# Altium schematic sheet D33_POWER_SCHEMATIC.SchDoc
size A3; SheetNumber: 4; SheetTotal: 7
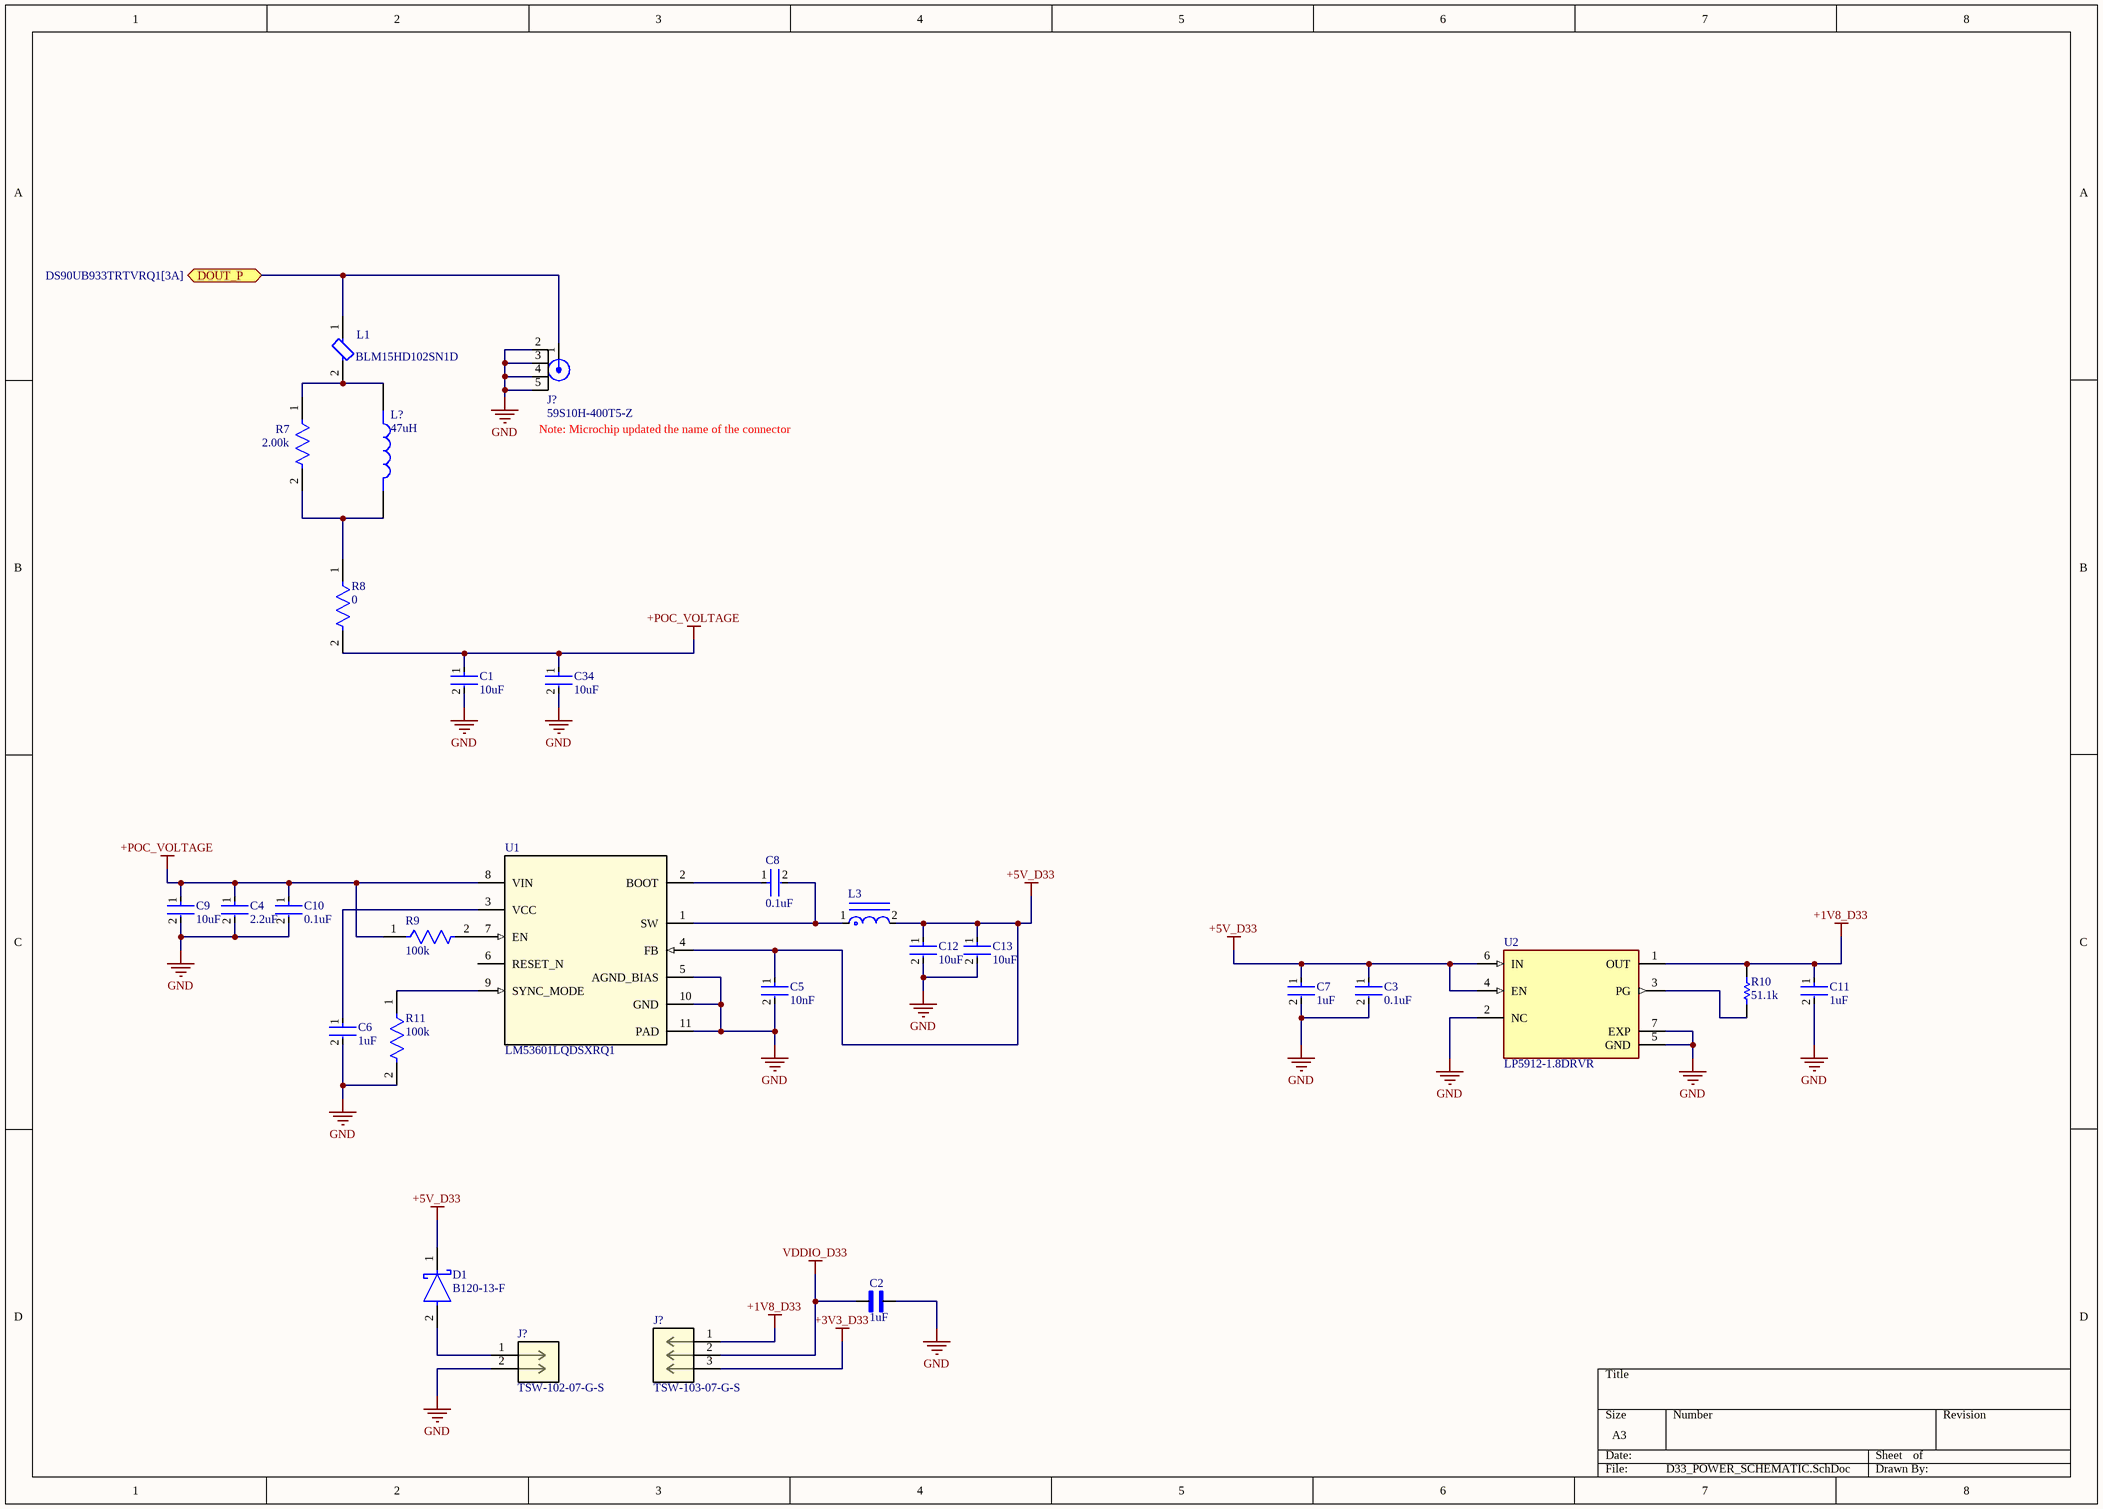
[diagram p0: D33_POWER_SCHEMATIC.SchDoc]

## Parts
(Parts that share a designator on the sheet are numbered #1, #2 ... from top to bottom, then left to right.)
C1  10uF  [FP-GRM188-0_2-MFG]
C2  1uF  [CAPC2012X94N]
C3  0.1uF  [FP-C1005-050-0_05-IPC_C]
C4  2.2uF  [FP-GRT155-0_2-IPC_C]
C5  10nF  [FP-GCM155-0_05-IPC_C]
C6  1uF  [FP-C1005-050-0_05-IPC_B]
C7  1uF  [FP-GRM15-0_1-MFG]
C8  0.1uF  [FP-C1005-050-0_05-IPC_C]
C9  10uF  [FP-GRM188-0_2-MFG]
C10  0.1uF  [FP-C1005-050-0_05-IPC_C]
C11  1uF  [FP-C1005-050-0_05-IPC_B]
C12  10uF  [FP-GRM188-0_2-MFG]
C13  10uF  [FP-GRM188-0_2-MFG]
C34  10uF  [FP-GRM188-0_2-MFG]
D1  B120-13-F  [FP-SMA-MFG]
J?#1  59S10H-400T5-Z  [59S10H400T5Z]
J?#2  TSW-103-07-G-S  [CON3_1X3_TU_TSW]
J?#3  TSW-102-07-G-S  [CON2_1X2_TU_TSW]
L1  BLM15HD102SN1D  [FP-BLM15-0_05-IPC_C]
L3  (no value)  [FP-MPI4020V2-MFG]
L?  47uH  [IND_ADL3225V-470MT-TL000]
R7  2.00k  [FP-CRCW0402-e3-IPC_C]
R8  0  [FP-CRCW0402-e3-IPC_C]
R9  100k  [FP-CRCW0402-e3-IPC_C]
R10  51.1k  [RESC1005X40X25NL05T05]
R11  100k  [FP-CRCW0402-e3-IPC_C]
U1  LM53601LQDSXRQ1  [DSX0010A]
U2  LP5912-1.8DRVR  [SON65P200X200X80-7N]

## Ports
DOUT_P (bidir, see DS90UB933TRTVRQ1[3A])

## Nets
+1V8_D33: C11.1 J?#2.1 R10.2 U2.1(OUT)
+3V3_D33: J?#2.3
+5V_D33: C3.1 C5.1 C7.1 C12.1 C13.1 D1.1(C) L3.2 U1.4(FB) U2.4(EN) U2.6(IN)
+POC_VOLTAGE: C1.1 C4.1 C9.1 C10.1 C34.1 R8.2 R9.1 U1.8(VIN)
GND: C1.2 C2.1 C3.2 C4.2 C5.2 C6.2 C7.2 C9.2 C10.2 C11.2 C12.2 C13.2 C34.2 J?#1.2 J?#1.3 J?#1.4 J?#1.5 J?#3.2 R11.2 U1.5(AGND_BIAS) U1.10(GND) U1.11(PAD) U2.2(NC) U2.5(GND) U2.7(EXP)
VDDIO_D33: C2.2 J?#2.2
DOUT_P: J?#1.1 L1.1 ; port DOUT_P
NetC6_1: C6.1 U1.3(VCC)
NetC8_1: C8.1 U1.2(BOOT)
NetC8_2: C8.2 L3.1 U1.1(SW)
NetD1_2: D1.2(A) J?#3.1
NetL1_2: L1.2 L?.1 R7.1
NetL?_2: L?.2 R7.2 R8.1
NetR9_2: R9.2 U1.7(EN)
NetR10_1: R10.1 U2.3(PG)
NetR11_1: R11.1 U1.9(SYNC_MODE)

Not connected (* = marked no-connect by the designer): U1 6(RESET_N)

## Notes on the sheet
- (near J?#1) Note: Microchip updated the name of the connector

## Library data of the parts
C1 C9 C12 C13 C34 = CMP-2006-02520-2: Chip Multilayer Ceramic Capacitors for General Purpose, 0603, 10uF, X5R, 15%, 20%, 25V; Tolerance: 20%; Resistor Type: Ceramic; Voltage: 25V; Max Operating Temperature: 85°C; Min Operating Temperature: -55°C; Capacitance: 10uF; Dielectric: X5R; Lead Free: Lead Free; REACH SVHC: No SVHC; Case/Package: 0603; Mount: Surface Mount; Voltage Rating (DC): 25V; Height: 0.8mm; Length: 1.6mm; Thickness: 0.031inch; Width: 0.031inch; Termination: SMD/SMT; Case Code (Imperial): 0603; Case Code (Metric): 1608; Package Quantity: 1; Packaging: Tape and Reel; Depth: 0.8mm; Voltage Rating: 25V; Weight: 0.000222oz; Number of Pins: 2
C2 = 08055C105KAT2A: 1 ÂµF Â±10% 50V Ceramic Capacitor X7R 0805 (2012 Metric); MF: KYOCERA AVX Components Corporation; SnapEDA_Link: https://www.snapeda.com/parts/08055C105KAT2A/Kyocera/view-part/?ref=snap; Package: 2012 AVX; Value: *; MP: 08055C105KAT2A; Check_prices: https://www.snapeda.com/parts/08055C105KAT2A/Kyocera/view-part/?ref=eda
C3 C8 C10 = CMP-2000-05393-2: Multilayer Ceramic Capacitors 100nF ±10% 50V X7R SMD 0402; Voltage: 50V; Dielectric Material: Ceramic; Min Operating Temperature: -55°C; Depth: 0.5mm; Radiation Hardening: No; RoHS Compliant: Yes; Voltage Rating (DC): 50V; Lead Free: Lead Free; Resistor Type: Ceramic; Height: 0.5mm; Dielectric: X7R; Thickness: 0.022inch; Case/Package: 0402; Case Code (Metric): 1005; Termination: SMD/SMT; Capacitance: 100nF; Packaging: Tape and Reel; Max Operating Temperature: 125°C; Mount: Surface Mount; Package Quantity: 1; Width: 0.02inch; Weight: 2.3E-05oz; Voltage Rating: 50V; Tolerance: 10%; Construction: Flat; Case Code (Imperial): 0402; Length: 1mm; REACH SVHC: No SVHC; Series: C
C4 = CMP-06035-059281-1: Multi-Layer Ceramic Capacitor 2.2uF 25V X5R ±10% 0402 Paper T/R; Max Operating Temperature: 85°C; Case Code (Imperial): 0402; Width: 0.02inch; Min Operating Temperature: -55°C; Voltage Rating (DC): 25V; Tolerance: 10%; Length: 0.039inch; Ratings: AEC-Q200; Dielectric: X5R; Case Code (Metric): 1005; Thickness: 0.022inch; Voltage Rating: 25V; Packaging: Cut Tape; Case/Package: 0402; Mount: Surface Mount; Capacitance: 2.2uF
C5 = CMP-2008-03723-3: Ceramic Capacitor for Automotive 10nF ±10% 50VDC X7R 0402 Paper T/R; Voltage Rating (DC): 50V; Min Operating Temperature: -55°C; Radiation Hardening: No; Mount: Surface Mount; Thickness: 0.022inch; Package Quantity: 1; Case Code (Imperial): 0402; Lead Free: Lead Free; Case/Package: 0402; Depth: 0.5mm; Termination: SMD/SMT; Tolerance: 10%; Voltage: 50V; Packaging: Tape and Reel; Width: 0.02inch; REACH SVHC: No SVHC; Height: 0.5mm; Max Operating Temperature: 125°C; Case Code (Metric): 1005; Voltage Rating: 50V; Capacitance: 10nF; Ratings: AEC-Q200; Length: 1mm; Dielectric: X7R
C6 C11 = CMP-2000-06001-2: Multilayer Ceramic Capacitors 1μF ±10% 25V X5R SMD 0402; Package Quantity: 1; Radiation Hardening: No; Dielectric: X5R; REACH SVHC: No SVHC; RoHS Compliant: Yes; Case Code (Imperial): 0402; Voltage Rating: 25V; Termination: SMD/SMT; Max Operating Temperature: 85°C; Capacitance: 1uF; Series: C; Packaging: Tape and Reel; Tolerance: 10%; Voltage Rating (DC): 25V; Weight: 2.3E-05oz; Height: 0.5mm; Resistor Type: Ceramic; Thickness: 0.022inch; Min Operating Temperature: -55°C; Length: 1mm; Lead Free: Lead Free; Depth: 0.5mm; Dielectric Material: Ceramic; Width: 0.02inch; Case/Package: 0402; Case Code (Metric): 1005; Mount: Surface Mount
C7 = CMP-2008-04556-2: CAP CER 1UF 10V X5R 0402; Manufacturer Part Number: GRM155R61A105KE15D; Manufacturer: Murata; Material: Ceramic; Tolerance: 10%; Temperature Coefficient: 15%; Octopart: https://octopart.com/grm155r61a105ke15d-murata-197442; Lead Free: Yes; ComponentLink2Description: Datasheet; Temperature: -55°C to +85°C; Temperature Range High: +85°C; Height: 0.55mm; Capacitance: 1uF; Ipc Land Pattern Name: CAPC10050X50; ComponentLink2URL: https://search.murata.co.jp/Ceramy/image/img/A01X/G101/ENG/GRM155R61A105KE15-01A.pdf; Temperature Range Low: -55°C; Device Class L2: Capacitors; Voltage Rating: 10V; RoHS: TRUE; Device Class L1: Passive Components; Device Class L3: Ceramic Capacitors; Temperature Characteristic: X5R; Mouser Description: 0402 1 uF 10 V ±10% Tolerance X5R Surface Mount Multilayer Ceramic Capacitor; Automotive: No; Package: GRM15-0.1; Digikey Description: CAP CER 1UF 10V X5R 0402; Value: 1uF; Category: Cap
D1 = CMP-12790-000051-1: DIODE SCHOTTKY 20V 1A SMA; Manufacturer: Diodes Inc.; Value: 110pF; Standoff Height: 0.05mm; Max Junction Temp: +150°C; Max Surge Forward Current: 30A; Peak Reverse Current: 0.5mA; Height: 2.4mm; Temperature Range High: +150°C; Category: Diode; ComponentLink2Description: Datasheet; Forward Current: 1A; Device Class L1: Discrete Semiconductors; Footprint Url: https://www.diodes.com/assets/Package-Files/SMA.pdf; Device Class L3: Schottky Diodes; Reverse Voltage: 20V; Mouser Description: Schottky Diodes & Rectifiers 20V 1A; Temperature Range Low: -65°C; Automotive: No; Octopart: https://octopart.com/b120-13-f-diodes+inc.-40148653; Digikey Description: DIODE SCHOTTKY 20V 1A SMA; RoHS: TRUE; Lead Free: Yes; Manufacturer Part Number: B120-13-F; Package: SMA; Temperature: -65°C to +150°C; Capacitance: 110pF; Max Repetitive Reverse Voltage: 20V; ComponentLink2URL: https://www.diodes.com/assets/Datasheets/ds13002.pdf; Device Class L2: Diodes
J?#1 = 59S10H-400T5-Z: Connector; Manufacturer_Name: Rosenberger; Datasheet Link: https://products.rosenberger.com/radio-frequency/connectors/190827/59s10h-400t5-z-straight-plug-pcb-w.-housing#; Height: 12.45mm; Manufacturer_Part_Number: 59S10H-400T5-Z; Mouser Part Number: 476-59S10H-400T5-Z; Mouser Price/Stock: https://www.mouser.co.uk/ProductDetail/Rosenberger/59S10H-400T5-Z?qs=ehM%252BESVsXgwk%252Bgn9X1DFpA%3D%3D
J?#2 = TSW-103-07-G-S: Description; Manufacturer_Name: Samtec Inc; Copyright: Copyright (C) 2025 Ultra Librarian. All rights reserved.; Manufacturer_Part_Number: TSW-103-07-G-S; RefDes: RefDes; Type: Type
J?#3 = TSW-102-07-G-S: Description; Manufacturer_Name: Samtec Inc; Copyright: Copyright (C) 2025 Ultra Librarian. All rights reserved.; Manufacturer_Part_Number: TSW-102-07-G-S; RefDes: RefDes; Type: Type
L1 = CMP-0686-00279-4: Chip Ferrite Bead, 0402, 1000Ω @ 100MHz, 1.25Ω, 25%, 250mA; Manufacturer Series: BLM15H; Number of Functions: 1; DC Resistance-Max: 1.25R; Impedance: 1kR; Shielding: Unshielded; Material: Steel; Series: BLM15H; Case Code (Metric): 1005; Contact Plating: Tin; Width: 0.5mm; Current Rating: 250mA; Number of Circuits: 1; Min Operating Temperature: -55°C; Number of Pins: 2; Core Material: Ferrite; Packaging: Tape and Reel; DC Resistance (DCR): 1.25R; Height: 0.5mm; REACH SVHC: No SVHC; Max Current Rating: 250mA; Depth: 0.5mm; Tolerance: 25%; Termination: SMD/SMT; RoHS Compliant: Yes; Package Quantity: 1; Number of Lines: 1; Max DC Current: 250mA; Radiation Hardening: No; Resistance: 1.25R; Lead Free: Lead Free; DC Current: 250mA; Length: 1mm; Test Frequency: 100MHz; Frequency: 100MHz; Case Code (Imperial): 0402; Max Operating Temperature: 125°C; Case/Package: 0402; Military Standard: Not
L3 = CMP-00112-75645210-1: MPI4020V2-4R7-R Inductor Power Shielded Wirewound 4.7uH 20% 100KHz 2.7A 118mOhm DCR; Current Rating: 2.8A; Self Resonant Frequency: 24MHz; Resistance: 118mΩ; DC Resistance (DCR): 105mΩ; Saturation Current: 3A; Inductance: 4.7µH; Min Operating Temperature: -55°C; Length: 3.9878mm; Tolerance: 20%; Max Operating Temperature: 125°C; Composition: Wirewound; RoHS: Compliant; Shielding: Shielded; Width: 3.9878mm; Series Resistance: 118mΩ; Height: 2mm; Test Frequency: 100kHz; Height - Seated (Max): 2.032mm; Mount: Surface Mount; RMS Current (Irms): 2.7A; NexarPartId: 75645210
L? = ADL3225V-470MT-TL000: MF: {'manufacturer': u'TDK'}; Value: *; Availability: Unavailable; MP: ADL3225V-470MT-TL000; Price: None; Package: None
R7 R8 = CMP-2002-08122-2: RES Thick Film, 0Ω, 0.063W, 0402; Tolerance: 5%; Max Power Dissipation: 63mW; Voltage Rating: 50V; Temperature Coefficient: 100ppm/°C; Resistance: 0mR; Contact Plating: Tin; Height: 0.35mm; Radiation Hardening: No; Features: Automotive AEC-Q200; Composition: Thick Film; Width: 0.5mm; Weight: 2.3E-05oz; Termination: SMD/SMT; Packaging: Tape and Reel; Mount: Surface Mount; Case Code (Metric): 1005; Military Standard: Not; Min Operating Temperature: -55°C; Number of Terminations: 2; Package Quantity: 1; Case Code (Imperial): 0402; Depth: 0.5mm; Max Operating Temperature: 155°C; Case/Package: 0402; Power Rating: 63mW; Lead Free: Lead Free; Voltage Rating (DC): 50V; Length: 1mm
R9 R11 = CMP-2002-08123-3: RES Thick Film, 100kΩ, 1%, 0.063W, 100ppm/°C, 0402; Power Rating: 63mW; Resistance: 100kR; Voltage Rating (DC): 50V; Lead Free: Lead Free; Height: 0.35mm; Contact Plating: Tin; Min Operating Temperature: -55°C; Package Quantity: 10000; Case/Package: 0402; Temperature Coefficient: 100ppm/°C; Number of Terminations: 2; Packaging: Tape and Reel; Max Power Dissipation: 63mW; Case Code (Metric): 1005; Mount: Surface Mount; Width: 0.02inch; Termination: SMD/SMT; Length: 1mm; Number of Pins: 2; Weight: 2.3E-05oz; Radiation Hardening: No; Tolerance: 1%; Military Standard: Not; Features: Automotive AEC-Q200; Depth: 0.5mm; Composition: Thick Film; Max Operating Temperature: 155°C; Voltage Rating: 50V; Case Code (Imperial): 0402
R10 = CMP-2002-00975-1: Manufacturer: Panasonic; Part Number: ERJ-2RKF5112X
U1 = LM53601LQDSXRQ1: Automotive 3.5-V to 36-V, 1-A synchronous 2.1-MHz step-down converter 10-WSON -40 to 150; Manufacturer_Name: Texas Instruments; TYPE: TYPE; RefDes: RefDes; Copyright: Copyright (C) 2025 Ultra Librarian. All rights reserved.; Manufacturer_Part_Number: LM53601LQDSXRQ1; Datasheet: https://www.ti.com/lit/gpn/lm53601-q1
U2 = LP5912-1.8DRVR: 500-mAÂ low-noiseÂ low-IQÂ low-dropout voltage regulator with reverse current protect; MF: Texas Instruments; SnapEDA_Link: https://www.snapeda.com/parts/LP5912-1.8DRVR/Texas+Instruments/view-part/?ref=snap; Package: WSON-6 Texas Instruments; Value: *; MP: LP5912-1.8DRVR; Check_prices: https://www.snapeda.com/parts/LP5912-1.8DRVR/Texas+Instruments/view-part/?ref=eda